# EAGLE design modul (EAGLE 7.7.0)
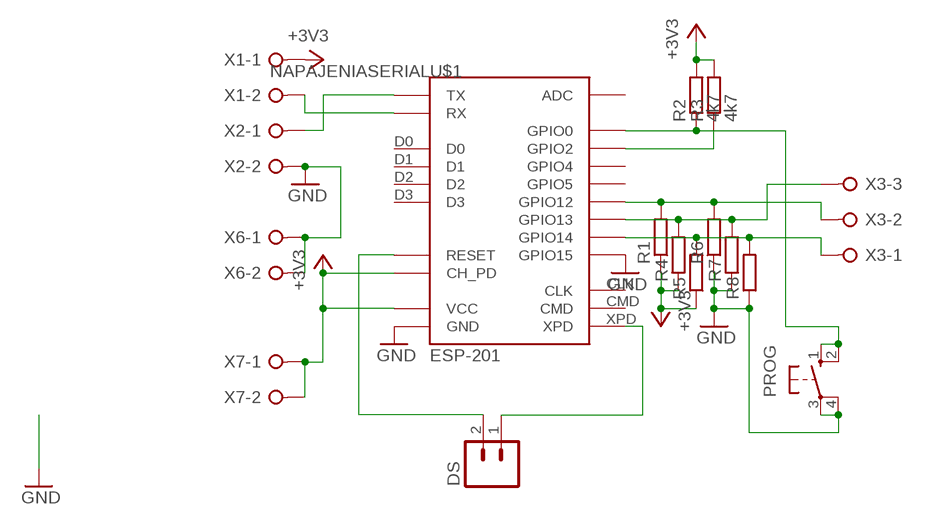
[diagram p0: schematic, sheet 1]

## Parts
DS  M02  [02P]
PROG  10-XX  [B3F-10XX]
R1  R-EU_0207/10  [0207/10]
R2  4k7  R-EU_0207/10  [0207/10]
R3  4k7  R-EU_0207/10  [0207/10]
R4  R-EU_0207/10  [0207/10]
R5  R-EU_0207/10  [0207/10]
R6  R-EU_0207/10  [0207/10]
R7  R-EU_0207/10  [0207/10]
R8  R-EU_0207/10  [0207/10]
U$1  ESP-201  [ESP-201]
X1  NAPAJENIASERIAL  W237-02P  [W237-132]
X2  W237-02P  [W237-132]
X3  W237-03P  [W237-133]
X6  W237-02P  [W237-132]
X7  W237-02P  [W237-132]

## Nets
+3V3: R1.1 R2.2 R3.2 R4.1 R5.1 U$1.3V3(VCC) U$1.3V3_2(VCC) U$1.3V3_3(VCC) U$1.CH_PD X1.1 X7.1 X7.2
GND: PROG.3(P) PROG.4(P1) R6.1 R7.1 R8.1 U$1.GND U$1.GND_2(GND) U$1.GND_3(GND) U$1.GPIO15 X2.2 X6.1 X6.2
N$1: U$1.TX X2.1
N$2: DS.2 U$1.RST(RESET)
N$3: R1.2 R6.2 U$1.GPIO12 X3.2
N$4: R4.2 R7.2 U$1.GPIO13 X3.3
N$5: DS.1 U$1.XPD
N$6: R5.2 R8.2 U$1.GPIO14 X3.1
N$7: U$1.RX X1.2
N$11: PROG.1(S) PROG.2(S1) R2.1 U$1.GPIO0
N$12: R3.1 U$1.GPIO2
Unconnected: U$1.ADC U$1.CLK U$1.CMD U$1.D0 U$1.D1 U$1.D2 U$1.D3 U$1.GPIO4 U$1.GPIO5

## Library data of the parts
DS = con-amp-quick:M02: AMP QUICK CONNECTOR; OC_FARNELL: unknown; OC_NEWARK: unknown
PROG = switch-omron:10-XX: OMRON SWITCH; MPN: B3F-1000; OC_FARNELL: 176432; OC_NEWARK: 36M3542
R1-R8 = rcl:R-EU_: RESISTOR, European symbol
U$1 = esp8266:ESP-201: ESP8266 Wifi Module ESP-201; DIMENSIONS: 25 x 35 mm; PINS: 26; PITCH: 0.1" / 2.54 mm
X1 X2 X6 X7 = con-wago-508:W237-02P: WAGO SREW CLAMP; OC_FARNELL: unknown; OC_NEWARK: unknown
X3 = con-wago-508:W237-03P: WAGO SREW CLAMP; OC_FARNELL: unknown; OC_NEWARK: unknown

## Board
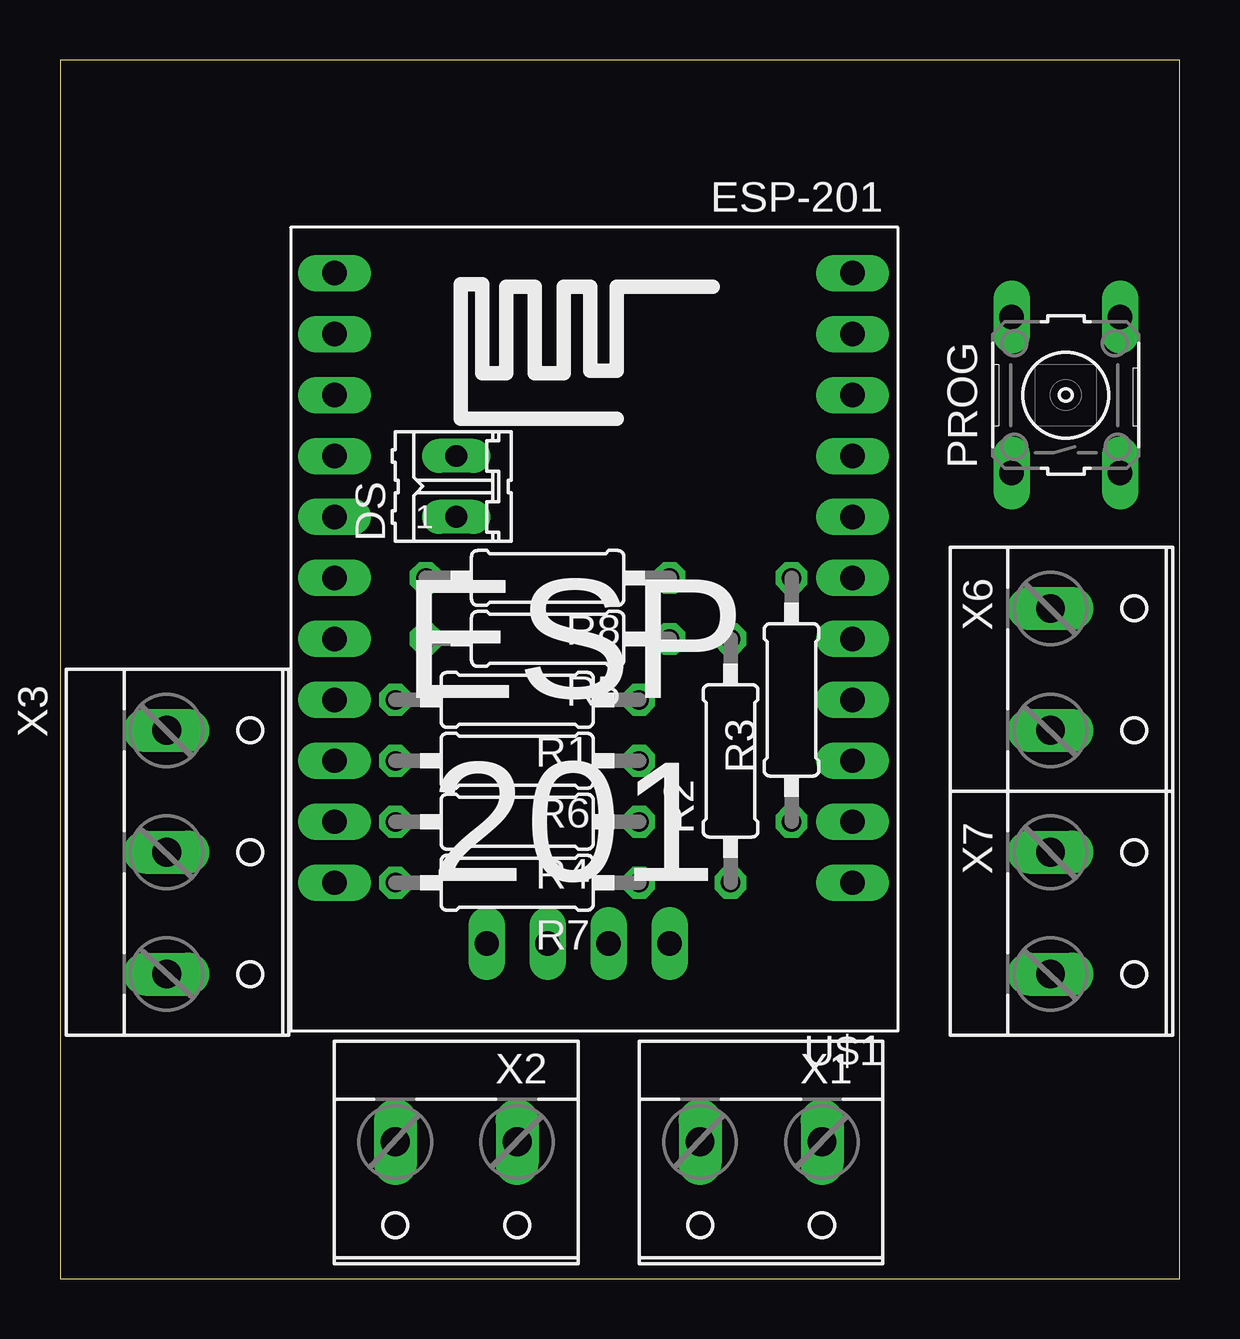
[diagram p1: board, top side]
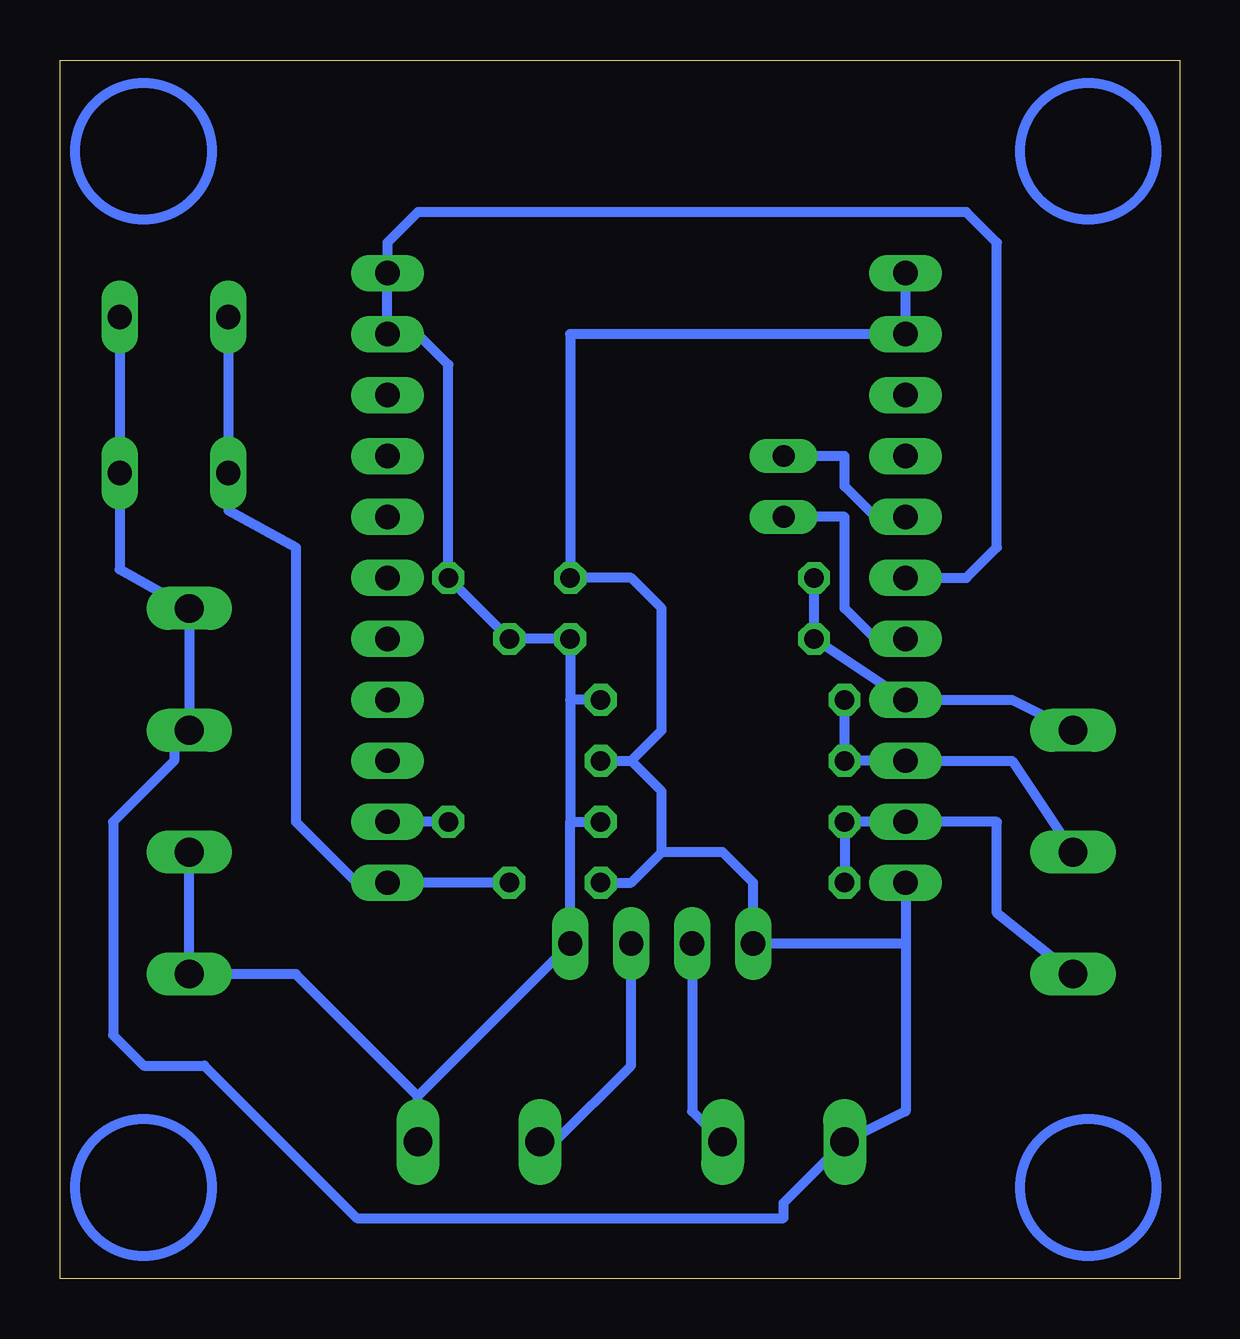
[diagram p2: board, bottom side, seen from below]

Size 46.66 x 50.79 mm. Coordinates in mm from the lower left corner, seen from the top.
Outline: 0,0 46.66,0 46.66,50.79 0,50.79 0,0
Copper layers (1*16): Top 0.035mm / dielectric 1.5mm / Bottom 0.035mm
Design rules "default": minimum track width 10mil, minimum drill 24mil, track to track 8mil, track to pad 8mil, pad to pad 8mil, via to via 8mil, smd to smd 8mil, copper to edge 40mil, drill to drill 8mil, minimum pad ring 10mil, minimum via ring 8mil, stop-mask expansion 4mil, vias tented up to drill 0mil, thermal gap 10mil

### Footprints (pad centres in the part's own frame; a part is rotated, then mirrored left to right if it is on the bottom)
02P = drill 0.914 long: 1 -1.27,0; 2 1.27,0
B3F-10XX = drill 1.016 long: 1 -3.251,2.261; 2 3.251,2.261; 3 -3.251,-2.261; 4 3.251,-2.261
0207/10 = drill 0.813 octagon: 1 -5.08,0; 2 5.08,0
ESP-201 = drill 1.016 long: 3V3 0,2.54; 3V3_2 0,0; 3V3_3 7.62,27.94; ADC 21.59,7.62; CH_PD 21.59,12.7; CLK 0,17.78; CMD 0,15.24; D0 0,12.7; D1 0,10.16; D2 0,20.32; D3 0,7.62; GND 21.59,2.54; GND_2 21.59,0; GND_3 15.24,27.94; GPIO0 0,25.4; GPIO2 0,22.86; GPIO4 0,5.08; GPIO5 21.59,5.08; GPIO12 21.59,20.32; GPIO13 21.59,22.86; GPIO14 21.59,17.78; GPIO15 21.59,25.4; RST 21.59,10.16; RX 10.16,27.94; TX 12.7,27.94; XPD 21.59,15.24
W237-132 = drill 1.194 long: 1 -2.54,-0.635; 2 2.54,-0.635
W237-133 = drill 1.194 long: 1 -5.08,-0.635; 2 0,-0.635; 3 5.08,-0.635

### Placement (x,y rotation side)
DS  16.51,33.02 90 top
PROG  41.91,36.83 90 top
R1  19.05,24.13 180 top
R2  27.94,21.59 90 top
R3  30.48,24.13 90 top
R4  19.05,19.05 180 top
R5  20.32,26.67 180 top
R6  19.05,21.59 180 top
R7  19.05,16.51 180 top
R8  20.32,29.21 180 top
U$1  33.02,41.91 180 top
X1  29.21,5.08 180 top
X2  16.51,5.08 180 top
X3  5.08,17.78 270 top
X6  41.91,25.4 270 top
X7  41.91,15.24 270 top

### Tracks (layer width: path | path; a pad name or v marks a point on that pad's centre or on a via)
+3V3
  Bottom 0.406: 25.4,19.05 U$1.3V3_3 31.75,7.62 | 25.4,19.05 R4.1 | R1.1 25.4,24.13 | 25.4,24.13 25.4,19.05 | 25.4,24.13 R5.1 R2.2 R3.2 30.48,38.1 31.75,39.37 U$1.3V3 U$1.3V3_2 33.02,43.18 31.75,44.45 8.89,44.45 7.62,43.18 7.62,30.48 8.89,29.21 U$1.CH_PD | X1.1 31.75,7.62 | 31.75,7.62 36.83,12.7 X7.2 | 41.91,12.7 X7.2 | X7.2 X7.1
GND
  Bottom 0.406: U$1.GPIO15 11.43,13.97 | 11.43,13.97 U$1.GND_3 17.78,16.51 19.05,17.78 21.59,17.78 | 11.43,13.97 11.43,6.99 X2.2 16.51,3.17 16.51,2.54 34.29,2.54 40.64,8.89 43.18,8.89 44.45,10.16 44.45,19.05 41.91,21.59 41.91,22.86 41.27,23.5 X6.1 | R7.1 22.86,16.51 21.59,17.78 | 21.59,17.78 21.59,20.32 22.86,21.59 | R6.1 22.86,21.59 | 22.86,21.59 21.59,22.86 21.59,27.94 22.86,29.21 R8.1 25.4,39.37 U$1.GND U$1.GND_2 | X6.1 44.17,29.57 PROG.3 PROG.4 | X6.1 X6.2
N$1
  Bottom 0.406: U$1.TX 20.32,6.99 X2.1
N$2
  Bottom 0.406: U$1.RST 12.7,31.75 13.97,33.02 13.97,34.29 DS.2
N$3
  Bottom 0.406: X3.2 6.99,21.59 U$1.GPIO12 R6.2 R1.2
N$4
  Bottom 0.406: X3.3 7.62,15.24 7.62,19.05 U$1.GPIO13 R4.2 R7.2
N$5
  Bottom 0.406: U$1.XPD 12.7,26.67 13.97,27.94 13.97,31.75 DS.1
N$6
  Bottom 0.406: X3.1 6.99,24.13 U$1.GPIO14 R5.2 R8.2
N$7
  Bottom 0.406: X1.2 26.04,5.71 22.86,8.89 U$1.RX
N$11
  Bottom 0.406: R2.1 U$1.GPIO0 34.29,16.51 36.83,19.05 36.83,30.48 39.65,32.03 PROG.2 PROG.1
N$12
  Bottom 0.406: R3.1 U$1.GPIO2
(copper drawn outside any net)
  shapes: Bottom circle x4